# EAGLE design PowerSound9x v002 (EAGLE 7.2.0)
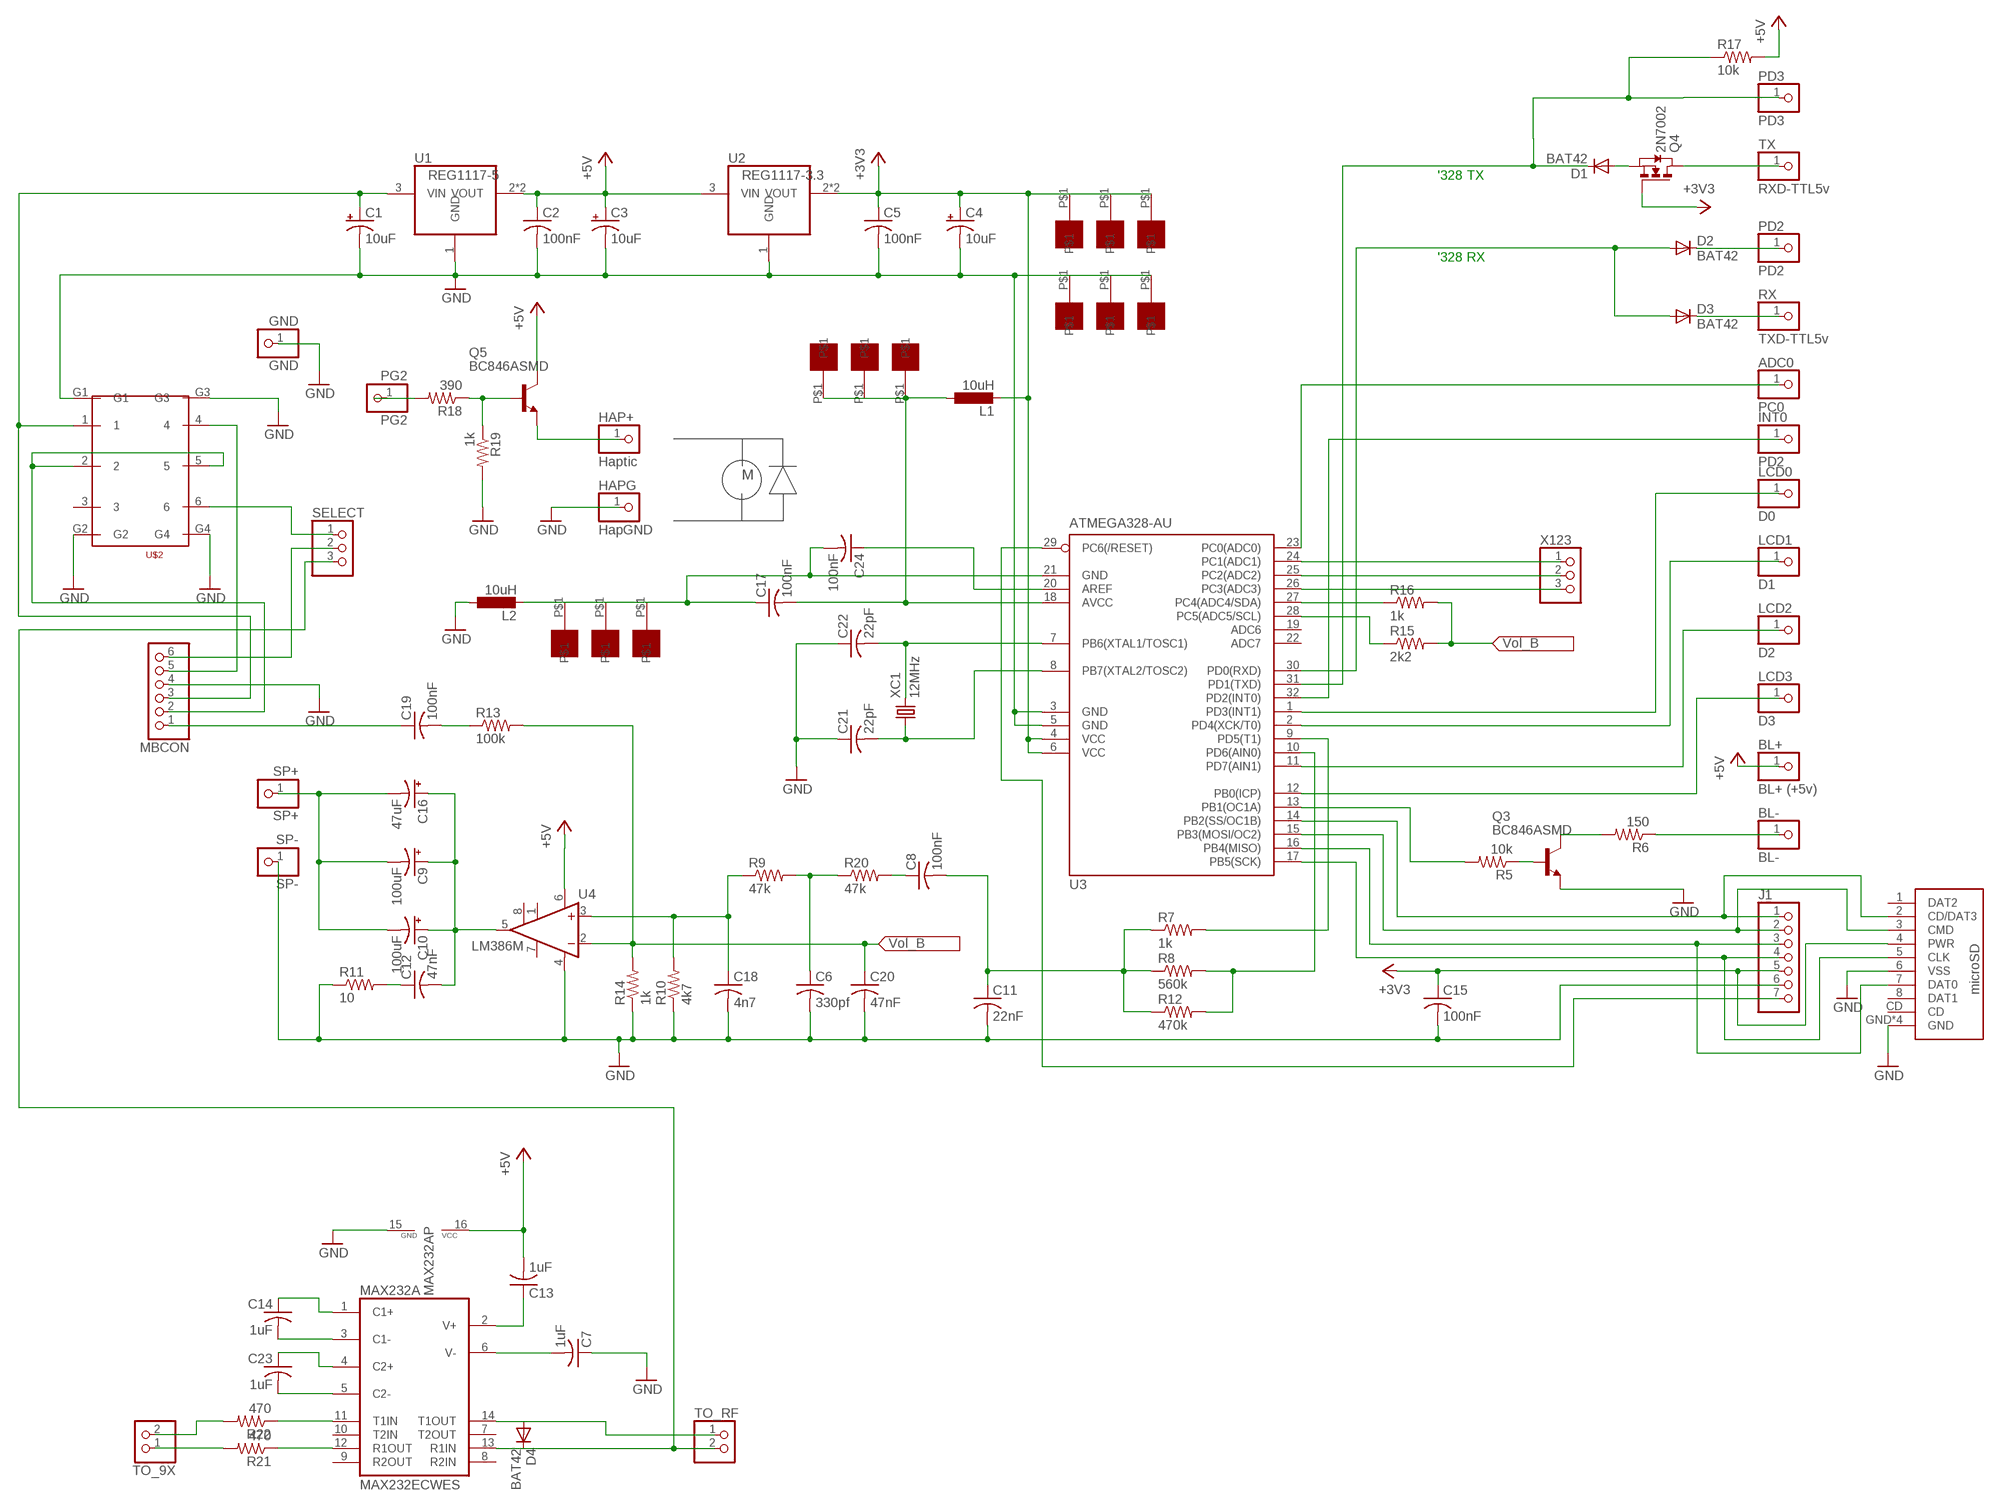
[diagram p0: schematic, sheet 1]

## Parts
ADC0  PC0  PINHD-1X1  [1X01]
BL+  BL+ (+5v)  PINHD-1X1  [1X01]
BL-  BL-  PINHD-1X1  [1X01]
C1  10uF  CPOL-USCT3528  [CT3528]
C2  100nF  C-USC1206  [C1206]
C3  10uF  CPOL-USCT3528  [CT3528]
C4  10uF  CPOL-USCT3528  [CT3528]
C5  100nF  C-USC1206  [C1206]
C6  330pf  C-USC1206  [C1206]
C7  1uF  C-USC1206  [C1206]
C8  100nF  C-USC1206  [C1206]
C9  100uF  CPOL-USCT6032  [CT6032]
C10  100uF  CPOL-USCT6032  [CT6032]
C11  22nF  C-USC1206  [C1206]
C12  47nF  C-USC1206  [C1206]
C13  1uF  C-USC1206  [C1206]
C14  1uF  C-USC1206  [C1206]
C15  100nF  C-USC1206  [C1206]
C16  47uF  CPOL-USCT6032  [CT6032]
C17  100nF  C-USC1206  [C1206]
C18  4n7  C-USC1206  [C1206]
C19  100nF  C-USC1206  [C1206]
C20  47nF  C-USC1206  [C1206]
C21  22pF  C-USC1206  [C1206]
C22  22pF  C-USC1206  [C1206]
C23  1uF  C-USC1206  [C1206]
C24  100nF  C-USC1206  [C1206]
D1  BAT42  DIODE-SOD123  [SOD123]
D2  BAT42  DIODE-SOD123  [SOD123]
D3  BAT42  DIODE-SOD123  [SOD123]
D4  BAT42  DIODE-SOD123  [SOD123]
GND  GND  PINHD-1X1  [1X01]
HAP+  Haptic  PINHD-1X1  [1X01]
HAPG  HapGND  PINHD-1X1  [1X01]
INT0  PD2  PINHD-1X1  [1X01]
J1  PINHD-1X7  [1X07]
L1  10uH  L-EUL3225M  [L3225M]
L2  10uH  L-EUL3225M  [L3225M]
LCD0  D0  PINHD-1X1  [1X01]
LCD1  D1  PINHD-1X1  [1X01]
LCD2  D2  PINHD-1X1  [1X01]
LCD3  D3  PINHD-1X1  [1X01]
MAX232A  MAX232ECWES  [SO16]
MBCON  PINHD-1X6  [1X06]
PD2  PD2  PINHD-1X1  [1X01]
PD3  PD3  PINHD-1X1  [1X01]
PG2  PG2  PINHD-1X1  [1X01]
Q3  BC846ASMD  [SOT23]
Q4  2N7002  NMOSSOT23  [SOT-23]
Q5  BC846ASMD  [SOT23]
R5  10k  R-US_R1206  [R1206]
R6  150  R-US_R1206  [R1206]
R7  1k  R-US_R1206  [R1206]
R8  560k  R-US_R1206  [R1206]
R9  47k  R-US_R1206  [R1206]
R10  4k7  R-US_R1206  [R1206]
R11  10  R-US_R1206  [R1206]
R12  470k  R-US_R1206  [R1206]
R13  100k  R-US_R1206  [R1206]
R14  1k  R-US_R1206  [R1206]
R15  2k2  R-US_R1206  [R1206]
R16  1k  R-US_R1206  [R1206]
R17  10k  R-US_R1206  [R1206]
R18  390  R-US_R1206  [R1206]
R19  1k  R-US_R1206  [R1206]
R20  47k  R-US_R1206  [R1206]
R21  470  R-US_R1206  [R1206]
R22  470  R-US_R1206  [R1206]
RX  TXD-TTL5v  PINHD-1X1  [1X01]
SELECT  PINHD-1X3  [1X03]
SP+  SP+  PINHD-1X1  [1X01]
SP-  SP-  PINHD-1X1  [1X01]
TO_9X  PINHD-1X2  [1X02]
TO_RF  PINHD-1X2  [1X02]
TX  RXD-TTL5v  PINHD-1X1  [1X01]
U1  REG1117-5  REG1117  [SOT223]
U2  REG1117-3.3  REG1117  [SOT223]
U3  ATMEGA328-AU  MEGA8-AI  [TQFP32-08]
U4  LM386M  LM386M-1  [SO08]
U$1  PAD  [PAD]
U$2  SS22H02SS22H02  [SS22H02]
U$3  112J-TDAR-R  [112J-TDAR-R]
U$4  PAD  [PAD]
U$5  PAD  [PAD]
U$6  PAD  [PAD]
U$7  PAD  [PAD]
U$8  PAD  [PAD]
U$9  PAD  [PAD]
U$10  PAD  [PAD]
U$11  PAD  [PAD]
U$12  PAD  [PAD]
U$13  PAD  [PAD]
U$14  PAD  [PAD]
X123  PINHD-1X3  [1X03]
XC1  12MHz  CRYSTALHC49UP  [HC49UP]

## Nets
+5V: BL+.1 C2.1 C3.+ C13.2 MAX232A.16(VCC) Q5.3(C) R17.2 U1.2(VOUT) U1.4(VOUT) U2.3(VIN) U4.6(VS)
B7: INT0.1 U3.32(PD2(INT0))
GND: C1.- C2.2 C3.- C4.- C5.2 C6.2 C7.1 C11.2 C15.2 C18.2 C20.2 C21.1 C22.1 GND.1 HAPG.1 J1.6 L2.1 MAX232A.15(GND) MBCON.4 Q3.2(E) R10.1 R11.1 R14.1 R19.2 SP-.1 U1.1(GND) U2.1(GND) U3.3(GND) U3.5(GND) U4.4(GND) U$2.G1 U$2.G2 U$2.G3 U$2.G4 U$3.6(VSS) U$3.GND U$3.GND1(GND) U$3.GND2(GND) U$3.GND3(GND) U$12.P$1 U$13.P$1 U$14.P$1
N$1: ADC0.1 U3.23(PC0(ADC0))
N$2: HAP+.1 Q5.2(E)
N$3: J1.2 U3.15(PB3(MOSI/OC2)) U$3.3(CMD)
N$4: J1.3 U3.16(PB4(MISO)) U$3.7(DAT0)
N$6: MAX232A.11(T1IN) R22.1
N$7: C22.2 U3.7(PB6(XTAL1/TOSC1)) XC1.2
N$8: C21.2 U3.8(PB7(XTAL2/TOSC2)) XC1.1
N$9: MAX232A.12(R1OUT) R21.1
N$10: R16.1 U3.27(PC4(ADC4/SDA))
N$11: R15.1 U3.28(PC5(ADC5/SCL))
N$12: MBCON.6 SELECT.2
N$13: SELECT.1 U$2.6
N$14: C17.2 L1.1 U3.18(AVCC) U$1.P$1 U$4.P$1 U$5.P$1
N$15: C9.- C10.- C16.- SP+.1
N$16: C12.1 R11.2
N$17: C9.+ C10.+ C12.2 C16.+ U4.5(OUT)
N$18: C18.1 R9.1 R10.2 U4.3(+IN)
N$19: C19.1 MBCON.1
N$20: C19.2 R13.1
N$21: J1.1 U3.14(PB2(SS/OC1B)) U$3.2(CD/DAT3)
N$22: C24.1 U3.20(AREF)
N$24: C6.1 R9.2 R20.1
N$25: C8.2 C11.1 R7.1 R8.1 R12.1
N$26: Q3.3(C) R6.2
N$27: R7.2 U3.9(PD5(T1))
N$28: R8.2 R12.2 U3.10(PD6(AIN0))
N$29: BL-.1 R6.1
N$30: LCD3.1 U3.12(PB0(ICP))
N$31: LCD2.1 U3.11(PD7(AIN1))
N$32: C1.+ MBCON.3 U1.3(VIN) U$2.1
N$33: Q3.1(B) R5.1
N$34: R5.2 U3.13(PB1(OC1A))
N$35: LCD1.1 U3.2(PD4(XCK/T0))
N$36: LCD0.1 U3.1(PD3(INT1))
N$37: D3.C RX.1
N$38: D1.C PD3.1 R17.1 U3.31(PD1(TXD))
N$39: D2.C PD2.1
N$40: PG2.1 R18.2
N$41: Q4.1(D) TX.1
N$42: D2.A D3.A U3.30(PD0(RXD))
N$43: Q5.1(B) R18.1 R19.1
N$44: C17.1 C24.2 L2.2 U3.21(GND) U$6.P$1 U$7.P$1 U$8.P$1
N$45: D1.A Q4.2(S)
N$49: J1.7 U3.29(PC6(/RESET))
N$57: J1.4 U3.17(PB5(SCK)) U$3.5(CLK)
N$58: C4.+ C5.1 C15.1 J1.5 L1.2 Q4.3(G) U2.2(VOUT) U2.4(VOUT) U3.4(VCC) U3.6(VCC) U$3.4(PWR) U$9.P$1 U$10.P$1 U$11.P$1 ; supply symbol labelled +3V3
N$61: C8.1 R20.2
N$73: D4.A MAX232A.14(T1OUT) TO_RF.1
N$77: U3.24(PC1(ADC1)) X123.1
N$78: U3.25(PC2(ADC2)) X123.2
N$79: U3.26(PC3(ADC3)) X123.3
N$83: MBCON.2 U$2.2 U$2.5
N$85: MBCON.5 U$2.4
N$86: D4.C MAX232A.13(R1IN) SELECT.3 TO_RF.2
N$88: R21.2 TO_9X.1
N$89: R22.2 TO_9X.2
N$90: C7.2 MAX232A.6(V-)
N$91: C23.2 MAX232A.5(C2-)
N$92: C23.1 MAX232A.4(C2+)
N$93: C14.2 MAX232A.3(C1-)
N$94: C14.1 MAX232A.1(C1+)
N$95: C13.1 MAX232A.2(V+)
VOL_B: C20.1 R13.2 R14.2 R15.2 R16.2 U4.2(-IN)
Unconnected: MAX232A.7(T2OUT) MAX232A.8(R2IN) MAX232A.9(R2OUT) MAX232A.10(T2IN) U3.19(ADC6) U3.22(ADC7) U4.1(GAIN) U4.7(BYPASS) U4.8(GAIN) U$2.3 U$3.1(DAT2) U$3.8(DAT1) U$3.CD

## Notes on the sheet
- '328 TX
- '328 RX
- M

## Library data of the parts
ADC0 BL+ BL- GND HAP+ HAPG INT0 LCD0 LCD1-LCD3 PD2 PD3 PG2 RX SP+ SP- TX = pinhead:PINHD-1X1: PIN HEADER
C1 C3 C4 C9 C10 C16 = resistor:CPOL-US: POLARIZED CAPACITOR, American symbol
C2 C5-C8 C11-C15 C17-C24 = resistor:C-US: CAPACITOR, American symbol
D1-D4 = diode:DIODE-: DIODE
J1 = pinhead:PINHD-1X7: PIN HEADER
L1 L2 = rcl:L-EU: INDUCTOR, European symbol
MAX232A = maxim-6b:MAX232ECWE: RS232 TRANSEIVER
MBCON = pinhead_new:PINHD-1X6: PIN HEADER
Q3 Q5 = transistor-npn:BC846*: NPN Transistor
Q4 = zetex:NMOSSOT23: MOS FET; OC_FARNELL: unknown; OC_NEWARK: unknown
R5-R22 = resistor:R-US_: RESISTOR, American symbol
SELECT X123 = pinhead_new:PINHD-1X3: PIN HEADER
TO_9X TO_RF = pinhead_new:PINHD-1X2: PIN HEADER
U1 U2 = burr-brown:REG1117: 800mA and 1A Low Dropout (LDO) Positive Regulator 1.8V, 2.5V, 2.85V, 3.3V, 5V, and Adj; MPN: REG1117; OC_FARNELL: 1097566; OC_NEWARK: 14P6981
U3 = atmel:MEGA8: MICROCONTROLLER 8 Kbytes FLASH, 1 kbytes SRAM, 512 bytes EEPROM, USART, 6-channel 10 bit ADC, 2-channel 8 bit ADC Pin compatible with Atmega48, ATMega88, ATMega168 Source: avr.lbr; MPN: ATMEGA8-16AU; OC_FARNELL: 9171371; OC_NEWARK: 73M8863
U4 = linear:LM386?-*: Low Voltage Audio Power Amplifier Source: http://cache.national.com/ds/LM/LM386.pdf
U$1 U$4-U$14 = andy:PAD
U$2 = andy:SS22H02
U$3 = andy:112J-TDAR-R
XC1 = crystal:CRYSTAL: CRYSTAL; OC_FARNELL: unknown; OC_NEWARK: unknown

## Board
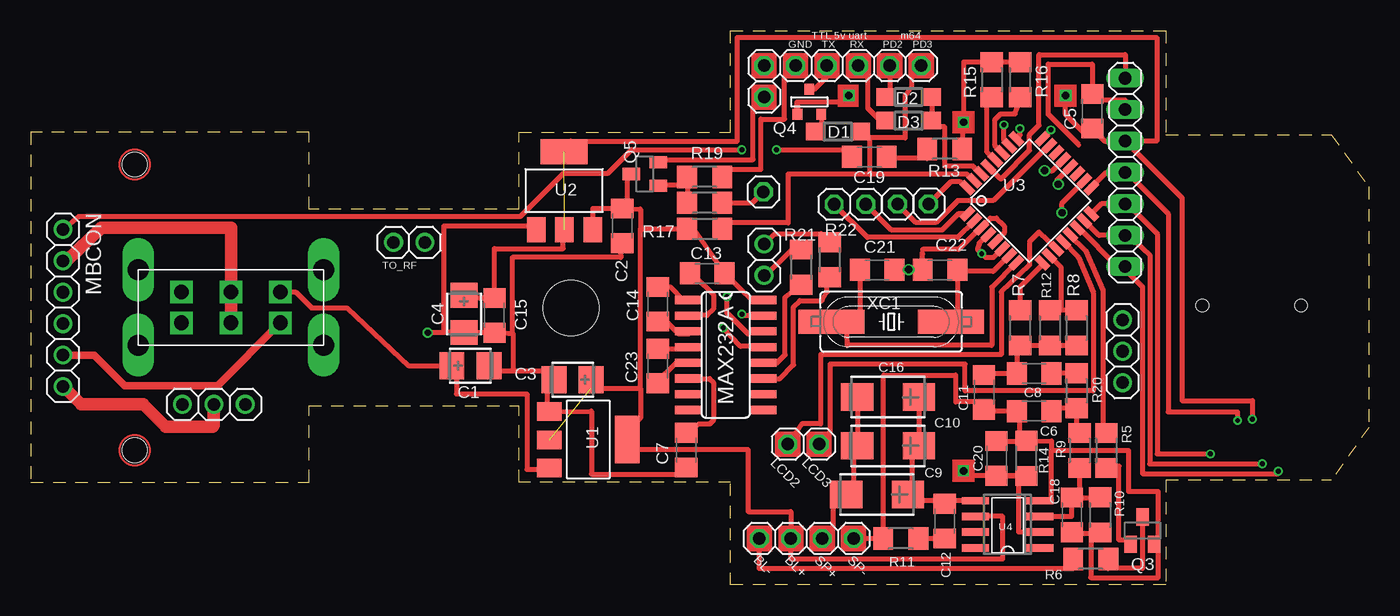
[diagram p1: board, top side]
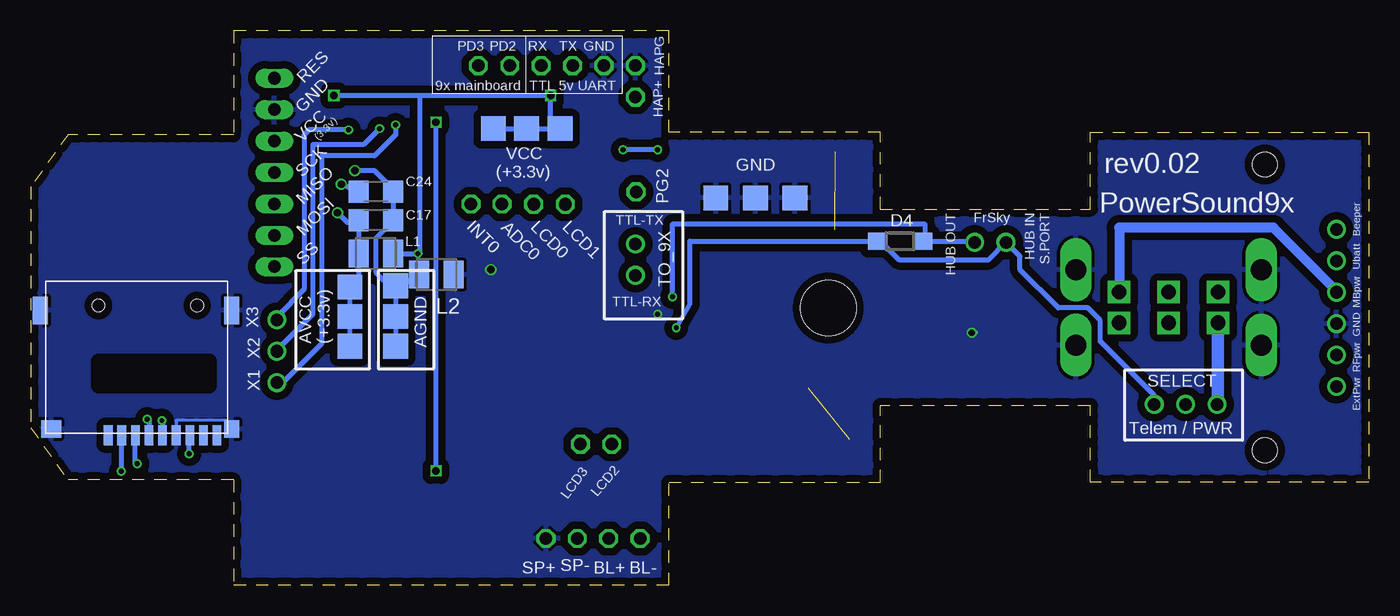
[diagram p2: board, bottom side, seen from below]

Size 108.2 x 44.8 mm. Coordinates in mm from the lower left corner, seen from the top.
Outline: 91.82,8.5 105.2,8.5 108.2,12.7 108.2,32.2 105.2,36.4 91.8,36.4 91.8,44.8 56.6,44.8 56.6,36.6 39.5,36.6 39.5,30.4 22.5,30.4 22.5,36.6 0,36.6 0,8.3 22.5,8.3 22.5,14.5 39.5,14.5 39.5,8.3 56.6,8.3 56.6,0 91.8,0 91.8,8.5
Copper layers (1*16): Top 0.035mm / dielectric 1.5mm / Bottom 0.035mm
Design rules "default": minimum track width 6mil, minimum drill 12mil, track to track 6mil, track to pad 6mil, pad to pad 6mil, via to via 6mil, smd to smd 0mil, copper to edge 10mil, drill to drill 10mil, minimum pad ring 10mil, minimum via ring 6mil, stop-mask expansion 2mil, vias tented up to drill 100mil, thermal gap 10mil
Holes 4.5 mm at 43.7,22.4
Holes 2 mm at 8.4,10.9 8.4,34

### Footprints (pad centres in the part's own frame; a part is rotated, then mirrored left to right if it is on the bottom)
1X01 = drill 1.016 octagon: 1 0,0
CT3528 = smd 2 x 2.2: + 1.5,0; - -1.5,0
C1206 = smd 1.6 x 1.8: 1 -1.4,0; 2 1.4,0
CT6032 = smd 2.6 x 2.2: + 2.5,0; - -2.5,0
SOD123 = smd 1.4 x 1.4: A 1.9,0; C -1.9,0
1X07 = drill 1.016 long: 1 -7.62,0; 2 -5.08,0; 3 -2.54,0; 4 0,0; 5 2.54,0; 6 5.08,0; 7 7.62,0
L3225M = smd 1.6 x 2.2: 1 -1.4,0; 2 1.4,0
SO16 = smd 0.66 x 2.032: 1 -4.445,-3.073; 2 -3.175,-3.073; 3 -1.905,-3.073; 4 -0.635,-3.073; 5 0.635,-3.073; 6 1.905,-3.073; 7 3.175,-3.073; 8 4.445,-3.073; 9 4.445,3.073; 10 3.175,3.073; 11 1.905,3.073; 12 0.635,3.073; 13 -0.635,3.073; 14 -1.905,3.073; 15 -3.175,3.073; 16 -4.445,3.073
1X06 = drill 1.016: 1 -6.35,0; 2 -3.81,0; 3 -1.27,0; 4 1.27,0; 5 3.81,0; 6 6.35,0
SOT23 = smd 1 x 1.4: 1 -0.95,-1.1; 2 0.95,-1.1; 3 0,1.1
SOT-23 = smd 0.787 x 0.889: 1 0.025,-1.016; 2 -0.94,1.016; 3 0.991,1.016
R1206 = smd 1.6 x 1.803: 1 -1.422,0; 2 1.422,0
1X03 = drill 1.016: 1 -2.54,0; 2 0,0; 3 2.54,0
1X02 = drill 1.016: 1 -1.27,0; 2 1.27,0
SOT223 = smd 1.499 x 2.007: 1 -2.261,-3.15; 2 0.025,-3.15; 3 2.311,-3.15 | smd 3.81 x 2.007: 4 0,3.15
TQFP32-08 = smd 1.27 x 0.559: 1 -4.293,2.8; 2 -4.293,2; 3 -4.293,1.2; 4 -4.293,0.4; 5 -4.293,-0.4; 6 -4.293,-1.2; 7 -4.293,-2; 8 -4.293,-2.8; 17 4.293,-2.8; 18 4.293,-2; 19 4.293,-1.2; 20 4.293,-0.4; 21 4.293,0.4; 22 4.293,1.2; 23 4.293,2; 24 4.293,2.8 | smd 0.559 x 1.27: 9 -2.8,-4.293; 10 -2,-4.293; 11 -1.2,-4.293; 12 -0.4,-4.293; 13 0.4,-4.293; 14 1.2,-4.293; 15 2,-4.293; 16 2.8,-4.293; 25 2.8,4.293; 26 2,4.293; 27 1.2,4.293; 28 0.4,4.293; 29 -0.4,4.293; 30 -1.2,4.293; 31 -2,4.293; 32 -2.8,4.293
SO08 = smd 0.6 x 2.2: 1 -1.905,-2.6; 2 -0.635,-2.6; 3 0.635,-2.6; 4 1.905,-2.6; 5 1.905,2.6; 6 0.635,2.6; 7 -0.635,2.6; 8 -1.905,2.6
PAD = smd 2 x 2: P$1 0,0
SS22H02 = drill 1.2 square: 1 -1.24,3.98; 2 -1.24,-0.02; 3 -1.24,-4.02; 4 1.26,3.98; 5 1.26,-0.02; 6 1.26,-4.02 | drill 1.7 long: G1 -3.04,7.48; G2 -3.04,-7.52; G3 3.06,7.48; G4 3.06,-7.52
112J-TDAR-R = smd 0.7 x 1.6: 1 2.25,10.5; 2 1.15,10.5; 3 0.05,10.5; 4 -1.05,10.5; 5 -2.15,10.5; 6 -3.25,10.5; 7 -4.35,10.5; 8 -5.45,10.5; CD -6.55,10.5 | smd 1.2 x 1.4: GND -7.75,10 | smd 1.2 x 2.2: GND1 -7.75,0.4; GND2 7.75,0.4 | smd 1.6 x 1.4: GND3 6.85,10 | hole 1: -4.95,0; 3.05,0
HC49UP = smd 5.334 x 1.93: 1 -4.826,0; 2 4.826,0

### Placement (x,y rotation side)
ADC0  70.1,30.8 0 top
BL+  61.47,3.76 0 top
BL-  58.92,3.76 0 top
C1  35.56,17.73 180 top
C2  47.83,29.04 270 top
C3  43.81,16.59 0 top
C4  35.03,21.92 90 top
C5  85.85,38.31 90 top
C6  81.15,14.05 180 top
C7  53,10.9 90 top
C8  81.15,17.1 180 top
C9  68.45,7.32 0 top
C10  69.34,11.26 0 top
C11  77.09,15.57 270 top
C12  73.91,5.16 90 top
C13  54.7,25.2 0 top
C14  50.7,22.7 270 top
C15  37.5,21.8 270 top
C16  69.34,15.19 0 top
C17  80.3,29.5 180 bottom
C18  84.2,5.67 270 top
C19  67.81,34.62 0 top
C20  78.1,10.24 90 top
C21  68.45,25.48 180 top
C22  73.53,25.48 0 top
C23  50.7,17.7 270 top
C24  80.3,31.8 0 bottom
D1  65.28,36.66 180 top
D2  70.99,39.45 0 top
D3  70.99,37.55 0 top
D4  37.9,27.8 0 bottom
GND  61.85,41.99 0 top
HAP+  59.31,39.45 0 top
HAPG  59.31,41.99 0 top
INT0  72.6,30.8 0 top
J1  88.52,33.35 90 top
L1  80.3,26.8 0 bottom
L2  75.4,25.1 180 bottom
LCD0  67.53,30.78 0 top
LCD1  64.97,30.78 0 top
LCD2  61.21,11.38 0 top
LCD3  63.75,11.38 0 top
MAX232A  56.2,18.6 270 top
MBCON  2.6,22.4 270 top
PD2  69.47,41.99 0 top
PD3  72.01,41.99 0 top
PG2  59.25,31.78 0 top
Q3  89.91,4.4 0 top
Q4  62.99,39.07 180 top
Q5  49.65,33.23 90 top
R5  86.99,10.88 90 top
R6  85.72,2.11 0 top
R7  80.01,20.78 90 top
R8  84.58,20.78 90 top
R9  84.83,10.88 90 top
R10  86.48,5.67 90 top
R11  70.36,3.76 0 top
R12  82.42,20.78 90 top
R13  73.91,35.26 0 top
R14  80.52,10.24 270 top
R15  77.72,40.85 90 top
R16  80.01,40.85 90 top
R17  54.5,28.8 180 top
R18  54.5,30.9 0 top
R19  54.5,33 0 top
R20  84.58,15.7 90 top
R21  62.3,25.7 90 top
R22  64.6,26.3 90 top
RX  66.93,41.99 0 top
SELECT  14.8,14.6 0 top
SP+  64,3.76 0 top
SP-  66.55,3.76 0 top
TO_9X  59.3,26.3 90 top
TO_RF  30.6,27.7 180 top
TX  64.39,41.99 0 top
U1  45.08,11.76 270 top
U2  43.12,31.88 0 top
U3  80.77,31.07 45 top
U4  78.99,4.91 90 top
U$1  82.4,19.3 0 bottom
U$2  16.2,22.45 270 top
U$3  99.7,22.6 180 bottom
U$4  82.4,21.7 0 bottom
U$5  82.4,24.1 0 bottom
U$6  78.7,24.2 0 bottom
U$7  78.7,21.7 0 bottom
U$8  78.7,19.3 0 bottom
U$9  65.4,36.9 0 bottom
U$10  68.1,36.9 0 bottom
U$11  70.8,36.9 0 bottom
U$12  46.4,31.3 0 bottom
U$13  49.6,31.3 0 bottom
U$14  52.8,31.3 0 bottom
X123  88.3,18.9 270 top
XC1  69.59,21.29 0 top

### Tracks (layer width: path | path; a pad name or v marks a point on that pad's centre or on a via)
+5V  (1 unrouted)
  Top 0.406: U4.6 78.61,5.54 78.61,2.11 61.47,2.11 BL+.1 61.47,5.92 58.04,5.92 58.04,10.93 48.16,10.93 U1.4 | U1.4 47.88,12.02 49.3,13.5 49.3,15.9 | 47.75,11.89 47.75,11.76 U1.4 | C3.+ 45.3,15.9 49.3,15.9 | 48.94,33.23 Q5.3 48.2,33.2 48.2,30.7 C2.1 | 49.3,28.8 R17.2 53.6,28.8 C13.2 58.42,23 MAX232A.16 | C2.1 49.3,30.4 49.3,28.8 | C2.1 45.43,30.44 U2.3 | 49.3,15.9 49.3,28.8
B7
  Top 0.406: U3.32 75.68,32.12 75.2,32.6 74.4,32.6 INT0.1
GND  (via drill 0.4, 0.5, 0.6)
  Top 0.254: 42.32,17.32 42.48,17.17 | 37.87,20.42 38.98,20.42 39,20.3 | 39,17.42 39.5,17.32
  Top 0.406: U1.1 41.93,13.9 | 33.4,29.04 41.09,29.04 U2.1 | 42.51,17.3 42.48,17.17 C3.- 42.31,16.72 41.78,16.72 41.78,14.03 U1.1 | SP-.1 R11.1 68.96,3.76 68.96,16.97 74.8,16.97 74.8,14.81 77.72,14.81 C11.2 76.96,14.05 C6.2 80.01,14.05 80.01,11.64 79.75,11.64 C20.2 80.87,11.64 R14.1 82.55,11.64 82.55,10.88 | C18.2 84.2,4.14 86.36,4.14 86.36,4.25 R10.1 86.46,4.27 85.72,4.27 85.72,0.59 91.18,0.59 91.18,2.87 | U3.5 78.74,28.47 78.74,29.04 78.1,29.67 77.59,29.67 76.89,28.96 U3.3 76.8,28.88 75.05,27.13 72.13,27.13 72.13,26.75 C22.1 C21.1 70.98,25.48 v71,25.5 | U4.4 82.55,6.81 82.55,10.88 | Q3.2 90.99,2.87 91.18,2.87 | U1.1 45.34,14.05 45.34,8.97 53.7,8.97 53.47,9.2 C7.1 | 82.55,10.88 88.77,10.88 88.77,7.57 91.18,7.57 91.18,2.87 | C1.- 37.08,17.32 39.5,17.32 42.32,17.32 | C2.2 47.62,27.64 47.72,26.49 38.96,26.49 38.96,20.31 38.15,20.4 C15.2 37.97,20.65 37.87,20.42 C4.- 33.4,20.42 33.4,29.04 | 84.75,35.59 82.29,38.05 82.29,42.12 85.85,42.12 C5.2 85.59,39.2 88.52,39.2 J1.6 | GND.1 60.96,41.1 60.96,37.67 59.05,37.67 59.05,33.61 56.64,33.61 56.13,33.51 R19.2 | U$2.G1 23.7,25.49 | 39,20.3 39,17.42 | MAX232A.15 57.62,21.77 v57.5,21.9 | 33.4,29.04 33.4,20.4 v32.1,20.4
  Bottom 0.254: U$3.GND 92.4,12.6 92.4,13.3 96.45,13.3 U$3.6
  Bottom 0.406: v57.5,21.9 57.6,21.9 | v32.1,20.4 31.8,20.4 | v71,25.5 71.2,25.5
  pour Bottom (isolate 0.61): 0.3,36.3 0.3,8.7 22.1,8.7 22.1,14.9 39.8,14.9 39.8,8.6 56.9,8.6 56.9,0.4 91.4,0.4 91.4,9 104.8,9 106.2,10.7 107.8,13 107.8,32 104.8,36.1 91.5,36.1 91.5,44.4 56.9,44.4 56.9,36.3 39.8,36.3 39.8,30 22.1,30 22.1,36.3
N$1
  Top 0.406: U3.23 82.3,35.52 77.85,31.07 74.97,31.07 73.2,29.3 71.6,29.3 ADC0.1
N$2
  Top 0.406: HAP+.1 58.42,38.56 58.42,34.4 51.39,34.4 Q5.2
N$3  (via drill 0.4)
  Top 0.406: U3.15 86.39,28.27 J1.2 88.83,28.27 90.5,26.7 90.5,9.8 v99.6,9.8
  Bottom 0.406: v99.6,9.8 99.75,9.9 U$3.3
N$4  (via drill 0.4)
  Top 0.406: U3.16 86.59,30.81 J1.3 88.69,30.81 91.1,28.4 91.1,10.6 v95.4,10.6
  Bottom 0.406: v95.4,10.6 95.4,12.05 U$3.7
N$6
  Top 0.406: MAX232A.11 60.59,16.7 61.7,17.8 61.7,22.5 62.2,23 64,23 64.4,23.7 64.4,24.68 R22.1
N$7
  Top 0.406: U3.7 79.11,26.62 77.85,25.35 74.55,25.35 C22.2 74.93,21.29 XC1.2 75.18,21.29 75.56,21.42
N$8
  Top 0.406: U3.8 79.69,26.05 77.72,24.08 77.72,19.38 66.04,19.38 65.97,21.33 | 65.97,21.33 XC1.1 | C21.2 67.05,21.26 65.97,21.33
N$9
  Top 0.406: MAX232A.12 60.37,17.96 61,18.6 61,23.28 R21.1
N$10
  Top 0.406: U3.27 78.54,34.95 77.97,35.51 77.97,37.62 78.45,38.1 79.6,38.1 80.01,39.25 R16.1
N$11
  Top 0.406: U3.28 77.96,34.39 77.34,35.01 77.34,38.92 R15.1
N$12
  Top 1.016: MBCON.6 4.05,14.6 9.1,14.6 10.9,12.8 14.7,12.8 14.8,12.9 SELECT.2
N$13
  Bottom 0.406: SELECT.1 12.18,14.6
  Bottom 1.016: 12.18,14.6 U$2.6
N$14  (via drill 0.6)
  Top 0.406: v83.4,30.1 83.4,30.87 U3.18
  Bottom 0.406: v83.4,30.1 82.6,29.3 C17.2 L1.1 81.7,24.8 U$5.P$1 U$4.P$1 U$1.P$1
N$15
  Top 0.406: C16.- C10.- 66.8,11.26 66.55,11 66.55,7.91 C9.- | C9.- 66.29,7.32 | C9.- 64.89,7.32 64.89,4.65 SP+.1
N$16
  Top 0.406: R11.2 C12.1
N$17
  Top 0.406: C9.+ 70.95,7.19 70.57,6.81 71.5,6.81 | U4.5 73.02,6.81 | 73.02,6.81 71.5,6.81 | 72.22,15.19 C16.+ C10.+ 71.24,11.26 71.24,7.07 71.5,6.81 | C12.2 73.02,6.81
N$18
  Top 0.406: U4.3 84.2,5.54 C18.1 | C18.1 86.48,7.07 R10.2 | C18.1 84.45,7.07 84.45,7.45 84.83,7.45 | 84.83,7.45 84.83,7.32 | 84.83,7.45 R9.1
N$19  (via drill 0.4)
  Top 0.406: MBCON.1 3.85,29.8 39.6,29.8 43.1,33.3 46.7,33.3 48.6,35.2 v57.5,35.2 | v60.3,35.2 66.1,35.2 66.42,34.88 C19.1
  Bottom 0.406: v57.5,35.2 v60.3,35.2
N$20
  Top 0.406: R13.1 72.87,34.85 72.51,34.5 69.34,34.5 C19.2
N$21  (via drill 0.4)
  Top 0.406: v100.9,9.2 100.9,9 89.9,9 89.9,24.1 88.52,25.48 J1.1 87.88,25.73 84.71,28.91 84.68,28.88 U3.14
  Bottom 0.406: v100.9,9.2 100.85,9.1 U$3.2
N$22  (via drill 0.6)
  Top 0.406: 84.02,33.82 U3.20 83,32.73 v83.1,32.4
  Bottom 0.406: C24.1 v83.1,32.4
N$24
  Top 0.406: C6.1 82.68,14.28 R20.1 84.58,12.55 R9.2
N$25
  Top 0.406: R8.1 R12.1 R7.1 79.75,19.87 C8.2 77.59,17.1 C11.1
N$26
  Top 0.406: Q3.3 89.91,1.35 87.12,1.35 87.12,1.86 R6.2
N$27
  Top 0.406: U3.9 81.78,25.99 81.91,25.99 80.01,24.08 R7.2
N$28
  Top 0.406: U3.10 83.31,25.73 83.31,22.2 | 84.83,22.56 R8.2 83.31,22.2 | 83.31,22.2 R12.2
N$29
  Top 0.406: R6.1 84.3,1.35 58.92,1.35 BL-.1
N$30
  Top 0.406: U3.12 84.71,26.5 85.93,23.64 85.93,15.7 75.56,15.7 75.56,17.86 64.64,17.86 64.64,12.4 LCD3.1
N$31
  Top 0.406: U3.11 81.53,28.53 80.77,27.77 80.77,25.86 78.48,23.7 78.48,18.62 63.88,18.62 63.88,13.03 62.35,13.03 LCD2.1
N$32
  Top 0.406: U1.3 41.93,9.35 40.13,9.35 40.13,15.45 34.41,15.45 34.41,18.11 C1.+ 30.54,17.73 25.57,22.4 22.7,22.4 21.41,23.69 U$2.1
  Bottom 0.813: MBCON.3 2.6,23.8 7.7,28.9 20.18,28.9 U$2.1
N$33
  Top 0.406: 89.02,3.3 Q3.1 88.9,3.3 88.9,3.64 88.01,3.64 88.01,9.61 86.99,9.61 R5.1
N$34
  Top 0.406: U3.13 84.09,28.26 85.3,27.05 86.72,23.82 86.72,12.14 R5.2
N$35
  Top 0.406: U3.2 76.32,29.42 75,28.1 67.65,28.1 LCD1.1
N$36
  Top 0.406: U3.1 75.01,30.01 73.7,28.7 69.61,28.7 LCD0.1
N$37
  Top 0.406: D3.C 68.58,37.67 67.69,38.56 67.69,41.23 RX.1
N$38
  Top 0.406: U3.31 76.23,32.69 75.69,33.23 67.81,33.23 | 67.81,33.23 67.92,33.22 61.25,33.22 61.25,29.27 55.97,29.27 R17.1 | 67.81,33.23 67.81,36.02 67.4,36.5 | D1.C 66.93,37.04 67.4,36.5 | 67.4,36.5 67.75,36.15 70.74,36.15 70.74,39.58 71.24,40.34 71.24,41.23 PD3.1
N$39
  Top 0.406: PD2.1 69.47,39.57 D2.C
N$40
  Top 0.406: R18.2 58.37,30.9 PG2.1
N$41
  Top 0.406: Q4.1 63.37,40.09 64.39,41.1 TX.1
N$42
  Top 0.406: U3.30 76.8,33.26 76.2,33.86 73.91,33.86 73.91,37.04 72.76,37.04 D3.A D2.A
N$43
  Top 0.406: R19.1 53.1,32.59 53.1,32.34 | R18.1 53.14,30.46 53.14,32.34 53.1,32.34 | 53.1,32.34 50.75,32.34 Q5.1
N$44  (via drill 0.6)
  Top 0.406: v82,33.5 82.64,33.5 U3.21
  Bottom 0.406: v82,33.5 80.4,33.5 78.9,32 C24.2 C17.1 79,29.3 80.3,28 80.3,25.3 78.9,23.9 78.3,23.9 | 78.3,23.9 U$6.P$1 U$7.P$1 U$8.P$1 | L2.2 77.1,25.1 78.3,23.9
N$45
  Top 0.406: 63.32,36.97 D1.A 63.25,36.78 63.88,36.78 63.93,36.83 Q4.2
N$49
  Top 0.406: U3.29 78.42,32.85 78.48,32.85 80.77,35.13 80.77,36.4 81.53,37.16 81.53,42.88 88.52,42.88 J1.7
N$57  (via drill 0.4)
  Top 0.406: 85.78,32.15 86.99,33.35 J1.4 88.65,33.35 92,30 92,14 97.6,14 v97.6,13.3
  Top 0.61: U3.17 85.78,32.15
  Bottom 0.406: v97.6,13.3 97.55,13.3 U$3.5
N$58  (via drill 0.4, 0.6)  (1 unrouted)
  Top 0.406: C4.+ 35.08,23.2 C15.1 37.48,23.19 37.48,27.2 43.05,27.2 43.05,28.15 U2.2 | U3.4 76.7,27.64 76.58,27.13 v76.9,26.8 | v76.9,26.8 77.21,26.5 77.85,26.5 U3.6 | U2.4 43.69,35.89 57.15,35.89 57.15,44.28 91.06,44.28 91.06,35.89 J1.5 | 61.97,38.08 61.97,39.07 62,39.07 | 62,39.07 66.16,39.07 v66.16,39.58 | 62,39.07 Q4.3 | v83.69,39.58 83.69,38.05 85.34,36.4 C5.1 86.86,35.89 J1.5 | J1.5 93.1,31.3 93.1,14.9 98.8,14.9 v98.8,13.4 | v76.9,26.8
  Bottom 0.406: 76.7,39.58 v66.16,39.58 66.16,36.86 U$9.P$1 U$10.P$1 U$11.P$1 | 76.7,39.58 v83.69,39.58 | v98.8,13.4 98.65,13.4 U$3.4 | L1.2 v76.9,26.8 76.7,26.8 76.7,39.58
N$61
  Top 0.406: R20.2 82.68,17.12 C8.1
N$73  (via drill 0.4)
  Top 0.406: MAX232A.14 59.48,20.6 58,20.3 56.3,22 v56.3,23.3
  Bottom 0.406: v56.3,23.3 56.3,29.2 35.9,29.2 35.9,27.8 D4.A 31.97,27.8 TO_RF.1
N$77  (via drill 0.4)
  Top 0.406: U3.24 82.54,36.8 v82.5,36.8
  Bottom 0.406: v82.5,36.8 85.7,36.8 86.1,36.4 86.1,23.9 88.3,21.7 X123.1
N$78  (via drill 0.4)
  Top 0.406: U3.25 80,36.37 v80,36.9
  Bottom 0.406: v80,36.9 81.3,35.6 85.4,35.6 85.4,21.9 88.3,19 X123.2
N$79  (via drill 0.4)
  Top 0.406: U3.26 78.7,35.97 v78.7,37.2
  Bottom 0.406: v78.7,37.2 78.7,36.4 80.4,34.7 84.7,34.7 84.7,19.5 87.84,16.36 X123.3
N$83
  Top 1.016: MBCON.2 2.91,26.21 5.7,28.9 16.18,28.9 U$2.2 U$2.5
N$85
  Top 0.61: MBCON.5 5.11,18.59 7.6,16.1 15.09,16.1 U$2.4
N$86  (via drill 0.4)
  Top 0.406: MAX232A.13 59.51,19.3 57.4,19.3 v56,20.8
  Bottom 0.406: v56,20.8 54.9,22.7 54.9,27.8 D4.C 39.5,27.8 38,26.3 30.73,26.3 TO_RF.2 28.2,26.57 28.2,25.5 25.1,22.4 22.7,22.4 21.7,21.4 21.7,19.7 17.34,15.34 SELECT.3
N$88
  Top 0.406: TO_9X.1 59.43,25.03 61.4,27 62.18,27 R21.2
N$89
  Top 0.406: TO_9X.2 59.37,27.57 60.2,28.4 63.92,28.4 R22.2
N$90
  Top 0.406: MAX232A.6 54.91,16.7 55.2,16.4 55.2,13.3 54.9,13 54,13 C7.2
N$91
  Top 0.406: C23.2 50.5,16.3 52.2,18 53.39,18 MAX232A.5
N$92
  Top 0.406: C23.1 53.29,19.1 MAX232A.4
N$93
  Top 0.406: C14.2 51.4,21.3 52.4,20.3 53.22,20.3 MAX232A.3
N$94
  Top 0.406: C14.1 51.7,24.1 52.8,23 53.38,23 MAX232A.1
N$95
  Top 0.406: C13.1 53.8,24.9 55.2,23.5 55.2,22.3 54.7,21.8 53.45,21.8 MAX232A.2
VOL_B  (via drill 0.6)
  Top 0.406: U4.2 79.88,4.27 79.88,8.84 | 79.88,8.84 C20.1 80.13,8.84 R14.2 | 79.88,8.84 75.69,8.84 v75.44,9.22 | R13.2 75.33,37.55 v75.44,37.42 75.44,42.27 R15.2 R16.2
  Bottom 0.406: v75.44,9.22 v75.44,37.42
(copper drawn outside any net)
  shapes: Top area x17, Top circle x2

### Text on the board
tPlace: TTL 5v uart | m64
bNames: GND | TX | RX | PD2 | PD3 | TTL 5v UART | 9x mainboard | RES | (3.3v) | GND | VCC | GND | rev0.02 | VCC / (+3.3v) | SCK | MISO | PowerSound9x | HUB IN / S.PORT | FrSky | HUB OUT | TTL-TX | Beeper | MOSI | Ubatt | SS | TTL-RX | MBpwr | X3 | GND | AVCC / (+3.3v) | AGND | X2 | RFpwr | X1 | ExtPwr | Telem / PWR | LCD2 | LCD3 | BL- | BL+ | SP- | SP+
additional: Cut line